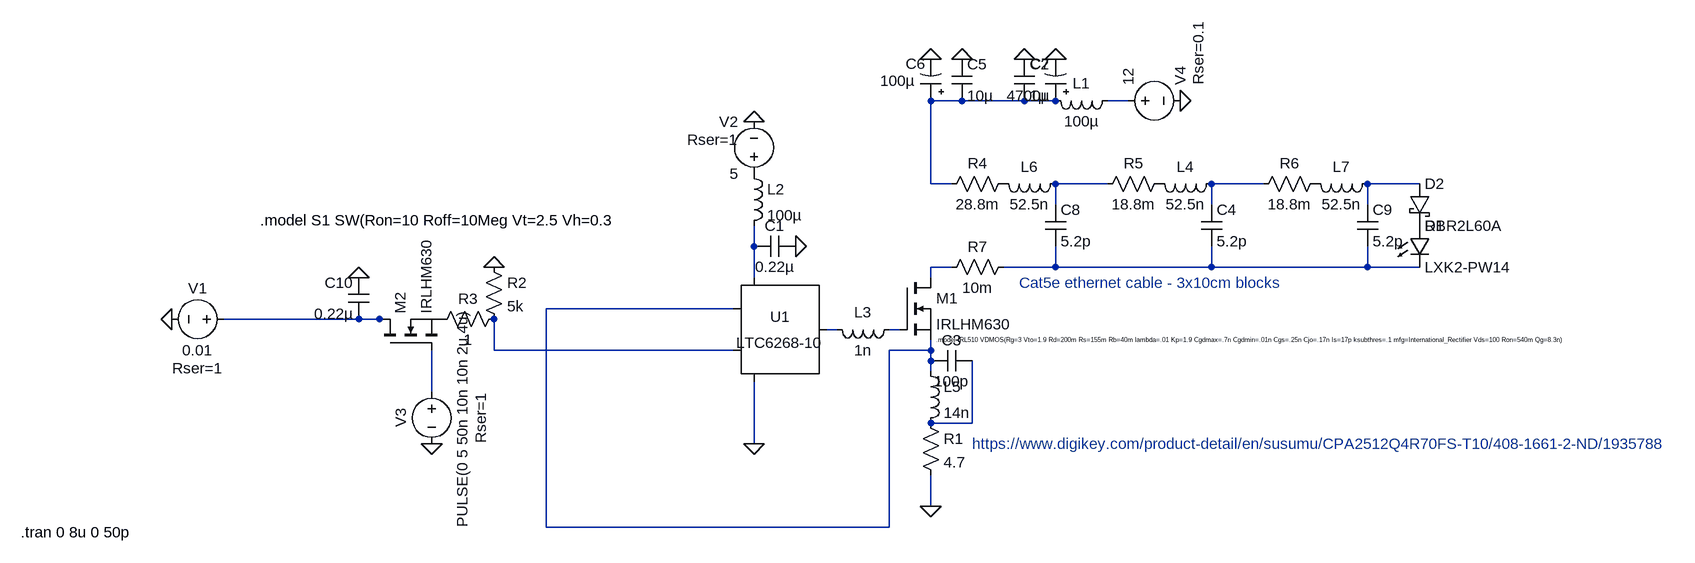
[diagram p0: schematic OPAmp to MOSFET test - draft 7c - best setup -stable - PCB impedance included.asc]
OPAmp to MOSFET test - draft 7c - best setup -stable - PCB impedance included.asc, the LTspice schematic file:
Version 4
SHEET 1 2768 680
WIRE 432 -192 384 -192
WIRE 528 -192 432 -192
WIRE 576 -192 528 -192
WIRE 688 -192 656 -192
WIRE 384 -64 384 -192
WIRE 416 -64 384 -64
WIRE 656 -64 576 -64
WIRE 896 -64 816 -64
WIRE 1136 -64 1056 -64
WIRE 576 -32 576 -64
WIRE 816 -32 816 -64
WIRE 1056 -32 1056 -64
WIRE 112 32 112 0
WIRE 416 64 384 64
WIRE 576 64 576 32
WIRE 576 64 496 64
WIRE 816 64 816 32
WIRE 816 64 576 64
WIRE 1056 64 1056 32
WIRE 1056 64 816 64
WIRE 1136 64 1056 64
WIRE 112 80 112 32
WIRE 384 80 384 64
WIRE 80 128 -208 128
WIRE -496 144 -704 144
WIRE -464 144 -496 144
WIRE -448 144 -464 144
WIRE 240 160 224 160
WIRE 336 160 320 160
WIRE -288 192 -288 144
WIRE 80 192 -288 192
WIRE 384 192 384 176
WIRE 384 192 320 192
WIRE 384 208 384 192
WIRE 384 224 384 208
WIRE -384 256 -384 192
WIRE 448 304 448 208
WIRE 448 304 384 304
WIRE 112 336 112 240
WIRE 384 432 384 384
WIRE -208 464 -208 128
WIRE 320 464 320 192
WIRE 320 464 -208 464
FLAG 112 -160 0
FLAG 112 336 0
FLAG 384 432 0
FLAG 528 -256 0
FLAG 176 32 0
FLAG -784 144 0
FLAG -288 64 0
FLAG 432 -256 0
FLAG 384 -256 0
FLAG 576 -256 0
FLAG 768 -192 0
FLAG -496 80 0
FLAG -384 336 0
SYMBOL nmos 336 80 R0
SYMATTR InstName M1
SYMATTR Value IRLHM630
SYMBOL voltage 112 -64 R180
WINDOW 0 24 96 Left 2
WINDOW 3 24 16 Left 2
WINDOW 123 0 0 Left 2
WINDOW 39 24 68 Left 2
SYMATTR InstName V2
SYMATTR Value 5
SYMATTR SpiceLine Rser=1
SYMBOL LED 1120 0 R0
SYMATTR InstName D1
SYMATTR Value LXK2-PW14
SYMBOL voltage 672 -192 R270
WINDOW 0 24 96 Left 2
WINDOW 3 24 16 Left 2
WINDOW 123 0 0 Left 2
WINDOW 39 24 124 Left 2
SYMATTR InstName V4
SYMATTR Value 12
SYMATTR SpiceLine Rser=0.1
SYMBOL cap 512 -256 R0
SYMATTR InstName C2
SYMATTR Value 1µ
SYMATTR SpiceLine V=100 Irms=5.63 Rser=0.0203188 Lser=0 mfg="KEMET" pn="C1210C105K1RAC" type="X7R"
SYMBOL ind 672 -208 R90
WINDOW 0 5 56 VBottom 2
WINDOW 3 32 56 VTop 2
SYMATTR InstName L1
SYMATTR Value 100µ
SYMBOL res 368 288 R0
SYMATTR InstName R1
SYMATTR Value 4.7
SYMATTR SpiceLine tol=1 pwr=16
SYMBOL cap 176 16 R90
WINDOW 0 0 32 VBottom 2
WINDOW 3 32 32 VTop 2
SYMATTR InstName C1
SYMATTR Value 0.22µ
SYMATTR SpiceLine V=100 Irms=2.1 Rser=0.0606238 Lser=0
SYMBOL ind 96 -96 R0
SYMATTR InstName L2
SYMATTR Value 100µ
SYMBOL voltage -688 144 R90
WINDOW 0 -32 56 VBottom 2
WINDOW 3 32 56 VTop 2
WINDOW 123 0 0 Left 2
WINDOW 39 60 56 VTop 2
SYMATTR InstName V1
SYMATTR Value 0.01
SYMATTR SpiceLine Rser=1
SYMBOL res -304 48 R0
SYMATTR InstName R2
SYMATTR Value 5k
SYMBOL cap 416 -256 R0
SYMATTR InstName C5
SYMATTR Value 10µ
SYMATTR SpiceLine V=35 Irms=8.06 Rser=0.00577565 Lser=0 mfg="KEMET" pn="C1210C106K6PAC" type="X5R"
SYMBOL polcap 400 -192 R180
WINDOW 0 24 57 Left 2
WINDOW 3 40 31 Left 2
SYMATTR InstName C6
SYMATTR Value 100µ
SYMATTR Description Capacitor
SYMATTR Type cap
SYMATTR SpiceLine V=16 Irms=2.65653 Rser=0.035 Lser=0
SYMBOL polcap 592 -192 R180
WINDOW 0 24 57 Left 2
WINDOW 3 24 8 Left 2
SYMATTR InstName C7
SYMATTR Value 4700µ
SYMATTR Description Capacitor
SYMATTR Type cap
SYMATTR SpiceLine V=35 Irms=2.03 Rser=0.033 Lser=0 mfg="Nichicon" pn="UPR1V472MRH" type="Al electrolytic"
SYMBOL schottky 1120 -64 R0
SYMATTR InstName D2
SYMATTR Value RBR2L60A
SYMATTR Description Diode
SYMATTR Type diode
SYMBOL ind 368 208 R0
SYMATTR InstName L5
SYMATTR Value 14n
SYMBOL cap 448 192 R90
WINDOW 0 0 32 VBottom 2
WINDOW 3 32 32 VTop 2
SYMATTR InstName C3
SYMATTR Value 100p
SYMBOL res 512 -80 R90
WINDOW 0 0 56 VBottom 2
WINDOW 3 32 56 VTop 2
SYMATTR InstName R4
SYMATTR Value 28.8m
SYMBOL ind 592 -80 R90
WINDOW 0 5 56 VBottom 2
WINDOW 3 32 56 VTop 2
SYMATTR InstName L6
SYMATTR Value 52.5n
SYMBOL cap 560 -32 R0
SYMATTR InstName C8
SYMATTR Value 5.2p
SYMBOL Opamps\\LTC6268-10 112 160 R0
SYMATTR InstName U1
SYMBOL res 752 -80 R90
WINDOW 0 0 56 VBottom 2
WINDOW 3 32 56 VTop 2
SYMATTR InstName R5
SYMATTR Value 18.8m
SYMBOL ind 832 -80 R90
WINDOW 0 5 56 VBottom 2
WINDOW 3 32 56 VTop 2
SYMATTR InstName L4
SYMATTR Value 52.5n
SYMBOL cap 800 -32 R0
SYMATTR InstName C4
SYMATTR Value 5.2p
SYMBOL res 992 -80 R90
WINDOW 0 0 56 VBottom 2
WINDOW 3 32 56 VTop 2
SYMATTR InstName R6
SYMATTR Value 18.8m
SYMBOL ind 1072 -80 R90
WINDOW 0 5 56 VBottom 2
WINDOW 3 32 56 VTop 2
SYMATTR InstName L7
SYMATTR Value 52.5n
SYMBOL cap 1040 -32 R0
SYMATTR InstName C9
SYMATTR Value 5.2p
SYMBOL res 512 48 R90
WINDOW 0 0 56 VBottom 2
WINDOW 3 32 56 VTop 2
SYMATTR InstName R7
SYMATTR Value 10m
SYMBOL ind 336 144 R90
WINDOW 0 5 56 VBottom 2
WINDOW 3 32 56 VTop 2
SYMATTR InstName L3
SYMATTR Value 1n
SYMBOL cap -480 144 R180
WINDOW 0 24 56 Left 2
WINDOW 3 24 8 Left 2
SYMATTR InstName C10
SYMATTR Value 0.22µ
SYMATTR SpiceLine V=100 Irms=2.1 Rser=0.0606238 Lser=0
SYMBOL nmos -464 192 R270
SYMATTR InstName M2
SYMATTR Value IRLHM630
SYMBOL voltage -384 240 R0
WINDOW 0 -32 56 VBottom 2
WINDOW 3 32 56 VTop 2
WINDOW 123 0 0 Left 2
WINDOW 39 60 56 VTop 2
SYMATTR InstName V3
SYMATTR Value PULSE(0 5 50n 10n 10n 2u 4u)
SYMATTR SpiceLine Rser=1
SYMBOL res -272 128 R90
WINDOW 0 0 56 VBottom 2
WINDOW 3 32 56 VTop 2
SYMATTR InstName R3
SYMATTR Value 1
TEXT 392 176 Left 0 !.model IRL510 VDMOS(Rg=3 Vto=1.9 Rd=200m Rs=155m Rb=40m lambda=.01 Kp=1.9 Cgdmax=.7n Cgdmin=.01n Cgs=.25n Cjo=.17n Is=17p ksubthres=.1 mfg=International_Rectifier Vds=100 Ron=540m Qg=8.3n)
TEXT -1016 472 Left 2 !.tran 0 8u 0 50p
TEXT 448 336 Left 2 ;https://www.digikey.com/product-detail/en/susumu/CPA2512Q4R70FS-T10/408-1661-2-ND/1935788
TEXT 520 88 Left 2 ;Cat5e ethernet cable - 3x10cm blocks
TEXT -648 -8 Left 2 !.model S1 SW(Ron=10 Roff=10Meg Vt=2.5 Vh=0.3

The netlist it stands for:
* OPAmp to MOSFET test - draft 7c - best setup -stable - PCB impedance included.asc
M1 N007 N012 N009 N009 IRLHM630
V2 P001 0 5 Rser=1
D1 P002 N008 LXK2-PW14
V4 N002 0 12 Rser=0.1
C2 0 N001 1µ V=100 Irms=5.63 Rser=0.0203188 Lser=0 mfg="KEMET" pn="C1210C105K1RAC" type="X7R"
L1 N002 N001 100µ
R1 N015 0 4.7 tol=1 pwr=16
C1 0 N006 0.22µ V=100 Irms=2.1 Rser=0.0606238 Lser=0
L2 P001 N006 100µ
V1 N010 0 0.01 Rser=1
R2 0 N013 5k
C5 0 N001 10µ V=35 Irms=8.06 Rser=0.00577565 Lser=0 mfg="KEMET" pn="C1210C106K6PAC" type="X5R"
C6 N001 0 100µ V=16 Irms=2.65653 Rser=0.035 Lser=0
C7 N001 0 4700µ V=35 Irms=2.03 Rser=0.033 Lser=0 mfg="Nichicon" pn="UPR1V472MRH" type="Al electrolytic"
D2 N005 P002 RBR2L60A
L5 N009 N015 14n
C3 N015 N009 100p
R4 P003 N001 28.8m
L6 N003 P003 52.5n
C8 N003 N008 5.2p
XU1 N013 N009 N011 N006 0 NC_01 LTC6268-10
R5 P004 N003 18.8m
L4 N004 P004 52.5n
C4 N004 N008 5.2p
R6 P005 N004 18.8m
L7 N005 P005 52.5n
C9 N005 N008 5.2p
R7 N008 N007 10m
L3 N012 N011 1n
C10 N010 0 0.22µ V=100 Irms=2.1 Rser=0.0606238 Lser=0
M2 N010 N014 P006 P006 IRLHM630
V3 N014 0 PULSE(0 5 50n 10n 10n 2u 4u) Rser=1
R3 N013 P006 1
.model D D
.lib standard.dio
.model NMOS NMOS
.model PMOS PMOS
.lib standard.mos
.model IRL510 VDMOS(Rg=3 Vto=1.9 Rd=200m Rs=155m Rb=40m lambda=.01 Kp=1.9 Cgdmax=.7n Cgdmin=.01n Cgs=.25n Cjo=.17n Is=17p ksubthres=.1 mfg=International_Rectifier Vds=100 Ron=540m Qg=8.3n)
.tran 0 8u 0 50p
* https://www.digikey.com/product-detail/en/susumu/CPA2512Q4R70FS-T10/408-1661-2-ND/1935788
* Cat5e ethernet cable - 3x10cm blocks
.model S1 SW(Ron=10 Roff=10Meg Vt=2.5 Vh=0.3
.lib LTC2.lib
.backanno
.end